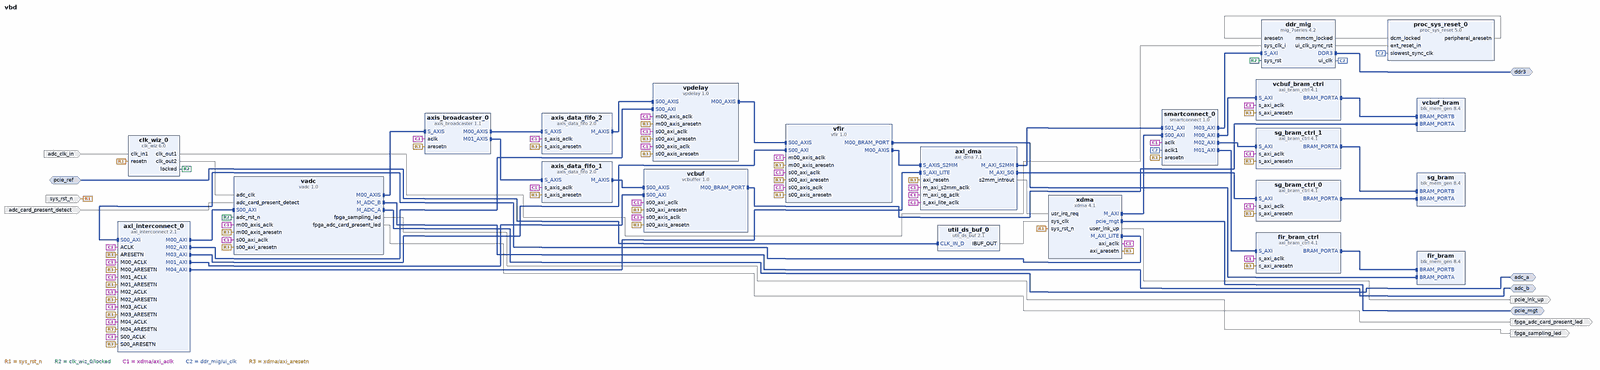
[diagram p0: block diagram of the top level, whole]
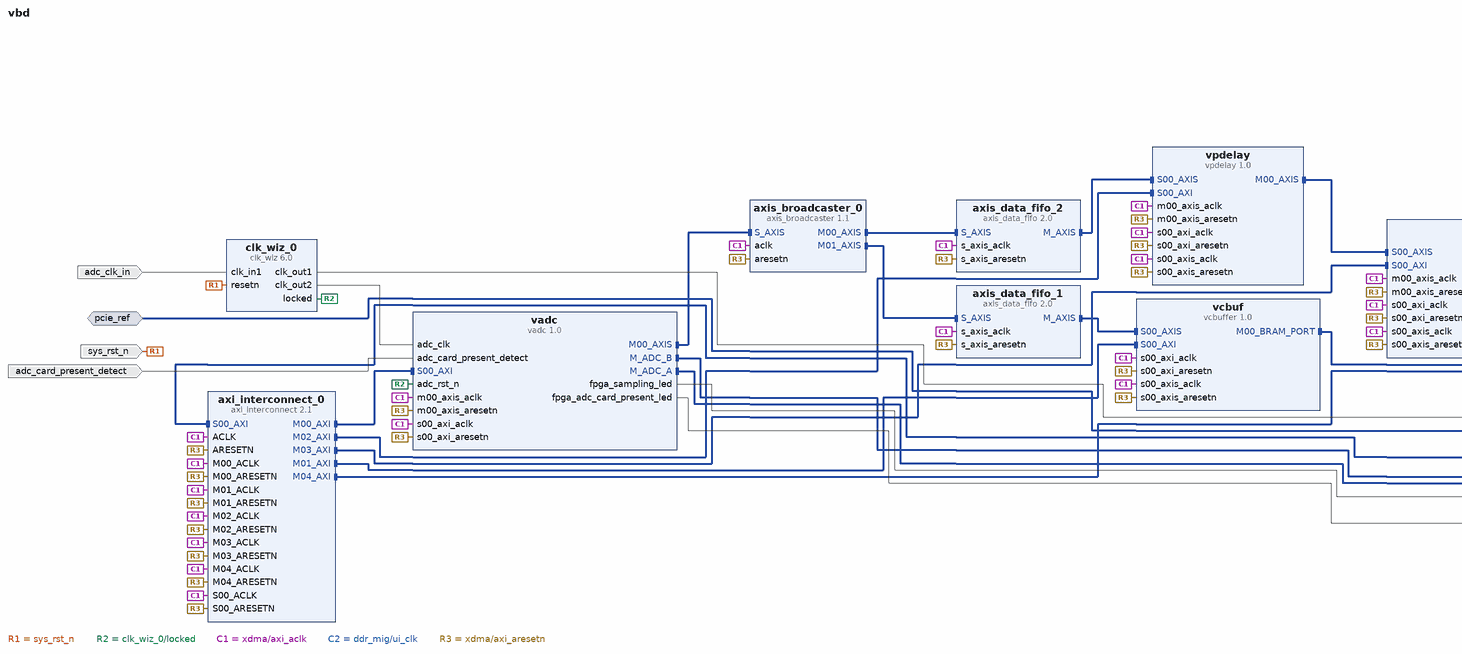
[diagram p1: block diagram of the top level, left part]
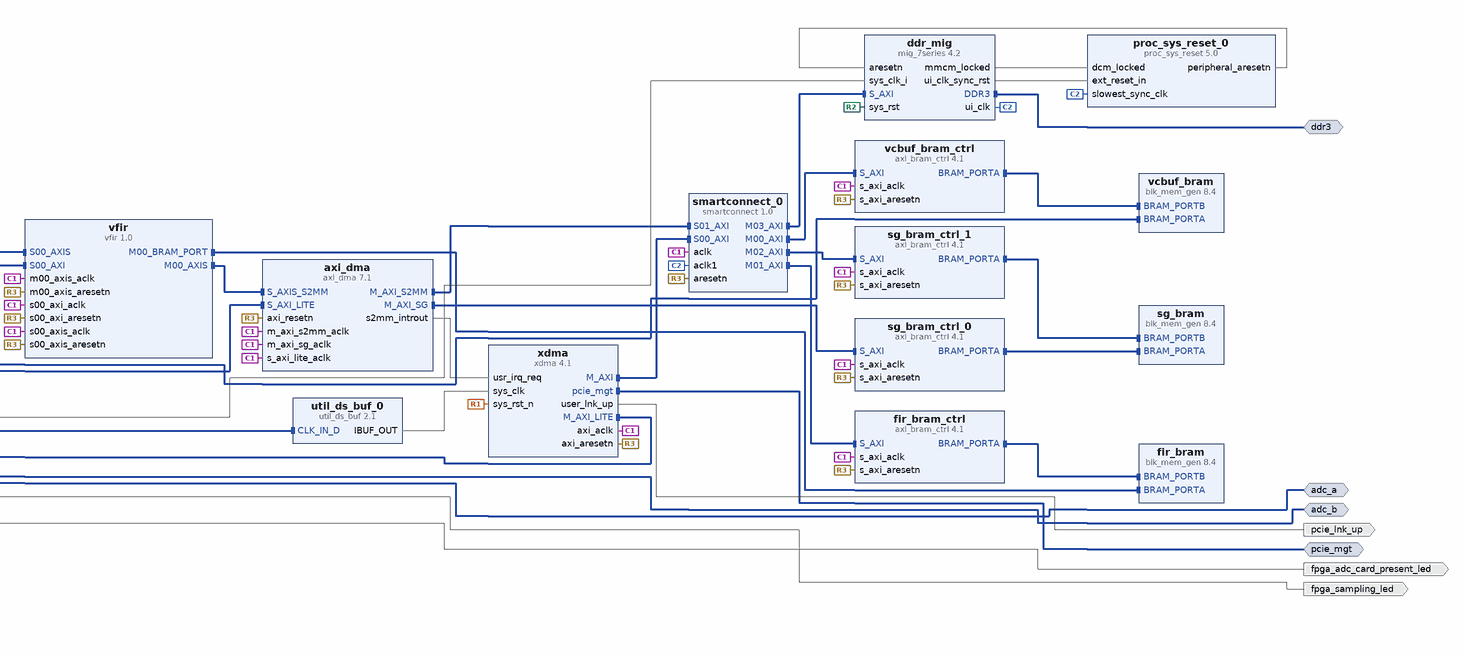
[diagram p2: block diagram of the top level, right part]
# Vivado block design vbd, xc7a100tfgg484-2, Vivado 2020.2
create_bd_design vbd

create_bd_intf_port -mode Master -vlnv xilinx.com:interface:ddrx_rtl:1.0 ddr3
create_bd_intf_port -mode Slave -vlnv xilinx.com:interface:diff_clock_rtl:1.0 pcie_ref
create_bd_intf_port -mode Master -vlnv xilinx.com:interface:pcie_7x_mgt_rtl:1.0 pcie_mgt
create_bd_intf_port -mode Master -vlnv xilinx.com:user:VUPRS_ADC_rtl:1.0 adc_a
create_bd_intf_port -mode Master -vlnv xilinx.com:user:VUPRS_ADC_rtl:1.0 adc_b
create_bd_port -dir I -type rst sys_rst_n
set_property -dict {CONFIG.POLARITY ACTIVE_LOW} [get_bd_ports sys_rst_n]
create_bd_port -dir O pcie_lnk_up
create_bd_port -dir I -type clk adc_clk_in
set_property -dict {CONFIG.FREQ_HZ 50000000} [get_bd_ports adc_clk_in]
create_bd_port -dir I adc_card_present_detect
create_bd_port -dir O fpga_sampling_led
create_bd_port -dir O fpga_adc_card_present_led

create_bd_cell -type ip -vlnv xilinx.com:ip:axis_broadcaster:1.1 axis_broadcaster_0
set_property -dict [list \
  CONFIG.HAS_TLAST 1 \
  CONFIG.HAS_TSTRB 1 \
  CONFIG.M00_TDATA_REMAP {tdata[31:0]} \
  CONFIG.M01_TDATA_REMAP {tdata[31:0]} \
  CONFIG.M_TDATA_NUM_BYTES 4 \
  CONFIG.S_TDATA_NUM_BYTES 4 \
] [get_bd_cells axis_broadcaster_0]
create_bd_cell -type ip -vlnv xilinx.com:ip:xdma:4.1 xdma
set_property -dict [list \
  CONFIG.PF0_DEVICE_ID_mqdma 9022 \
  CONFIG.PF2_DEVICE_ID_mqdma 9022 \
  CONFIG.PF3_DEVICE_ID_mqdma 9022 \
  CONFIG.axilite_master_en true \
  CONFIG.axisten_freq 125 \
  CONFIG.cfg_mgmt_if false \
  CONFIG.pciebar2axibar_axil_master 0x40000000 \
  CONFIG.pf0_device_id 7022 \
  CONFIG.pf0_interrupt_pin NONE \
  CONFIG.pf0_msix_cap_pba_bir BAR_3:2 \
  CONFIG.pf0_msix_cap_pba_offset 00008FE0 \
  CONFIG.pf0_msix_cap_table_bir BAR_3:2 \
  CONFIG.pf0_msix_cap_table_offset 00008000 \
  CONFIG.pf0_msix_cap_table_size 01F \
  CONFIG.pf0_msix_enabled true \
  CONFIG.pl_link_cap_max_link_speed 5.0_GT/s \
  CONFIG.pl_link_cap_max_link_width X2 \
  CONFIG.plltype QPLL1 \
  CONFIG.xdma_axilite_slave false \
  CONFIG.xdma_pcie_64bit_en true \
  CONFIG.xdma_rnum_chnl 2 \
  CONFIG.xdma_wnum_chnl 2 \
] [get_bd_cells xdma]
create_bd_cell -type ip -vlnv xilinx.com:ip:axis_data_fifo:2.0 axis_data_fifo_1
set_property -dict [list \
  CONFIG.FIFO_DEPTH 512 \
  CONFIG.HAS_AEMPTY 1 \
  CONFIG.HAS_AFULL 1 \
  CONFIG.HAS_TLAST 1 \
  CONFIG.HAS_TSTRB 1 \
  CONFIG.TDATA_NUM_BYTES 4 \
] [get_bd_cells axis_data_fifo_1]
create_bd_cell -type ip -vlnv xilinx.com:ip:axis_data_fifo:2.0 axis_data_fifo_2
set_property -dict [list \
  CONFIG.FIFO_DEPTH 128 \
  CONFIG.HAS_TLAST 1 \
  CONFIG.HAS_TSTRB 1 \
  CONFIG.TDATA_NUM_BYTES 4 \
] [get_bd_cells axis_data_fifo_2]
create_bd_cell -type ip -vlnv xilinx.com:ip:blk_mem_gen:8.4 vcbuf_bram
set_property -dict [list \
  CONFIG.Additional_Inputs_for_Power_Estimation false \
  CONFIG.Assume_Synchronous_Clk true \
  CONFIG.EN_SAFETY_CKT false \
  CONFIG.Enable_32bit_Address true \
  CONFIG.Enable_B Use_ENB_Pin \
  CONFIG.Memory_Type True_Dual_Port_RAM \
  CONFIG.Port_A_Write_Rate 50 \
  CONFIG.Port_B_Clock 100 \
  CONFIG.Port_B_Enable_Rate 100 \
  CONFIG.Port_B_Write_Rate 50 \
  CONFIG.Register_PortA_Output_of_Memory_Primitives false \
  CONFIG.Use_RSTA_Pin true \
  CONFIG.Use_RSTB_Pin true \
  CONFIG.use_bram_block BRAM_Controller \
] [get_bd_cells vcbuf_bram]
create_bd_cell -type ip -vlnv xilinx.com:ip:axi_bram_ctrl:4.1 vcbuf_bram_ctrl
set_property -dict {CONFIG.SINGLE_PORT_BRAM 1} [get_bd_cells vcbuf_bram_ctrl]
create_bd_cell -type ip -vlnv xilinx.com:ip:blk_mem_gen:8.4 fir_bram
set_property -dict [list \
  CONFIG.Additional_Inputs_for_Power_Estimation false \
  CONFIG.Assume_Synchronous_Clk true \
  CONFIG.EN_SAFETY_CKT false \
  CONFIG.Enable_32bit_Address true \
  CONFIG.Enable_B Use_ENB_Pin \
  CONFIG.Memory_Type True_Dual_Port_RAM \
  CONFIG.Port_A_Write_Rate 50 \
  CONFIG.Port_B_Clock 100 \
  CONFIG.Port_B_Enable_Rate 100 \
  CONFIG.Port_B_Write_Rate 50 \
  CONFIG.Register_PortA_Output_of_Memory_Primitives false \
  CONFIG.Use_RSTA_Pin true \
  CONFIG.Use_RSTB_Pin true \
  CONFIG.use_bram_block BRAM_Controller \
] [get_bd_cells fir_bram]
create_bd_cell -type ip -vlnv xilinx.com:ip:axi_bram_ctrl:4.1 fir_bram_ctrl
set_property -dict {CONFIG.SINGLE_PORT_BRAM 1} [get_bd_cells fir_bram_ctrl]
create_bd_cell -type ip -vlnv xilinx.com:ip:axi_dma:7.1 axi_dma
set_property -dict [list \
  CONFIG.c_include_mm2s 0 \
  CONFIG.c_include_s2mm 1 \
  CONFIG.c_sg_include_stscntrl_strm 0 \
  CONFIG.c_sg_length_width 26 \
] [get_bd_cells axi_dma]
create_bd_cell -type ip -vlnv xilinx.com:ip:mig_7series:4.2 ddr_mig
set_property -dict [list \
  CONFIG.BOARD_MIG_PARAM Custom \
  CONFIG.MIG_DONT_TOUCH_PARAM Custom \
  CONFIG.RESET_BOARD_INTERFACE Custom \
  CONFIG.XML_INPUT_FILE mig_a.prj \
] [get_bd_cells ddr_mig]
create_bd_cell -type ip -vlnv xilinx.com:ip:blk_mem_gen:8.4 sg_bram
set_property -dict [list \
  CONFIG.Additional_Inputs_for_Power_Estimation false \
  CONFIG.Assume_Synchronous_Clk false \
  CONFIG.EN_SAFETY_CKT false \
  CONFIG.Enable_32bit_Address true \
  CONFIG.Enable_B Use_ENB_Pin \
  CONFIG.Memory_Type True_Dual_Port_RAM \
  CONFIG.Port_A_Write_Rate 50 \
  CONFIG.Port_B_Clock 100 \
  CONFIG.Port_B_Enable_Rate 100 \
  CONFIG.Port_B_Write_Rate 50 \
  CONFIG.Register_PortA_Output_of_Memory_Primitives false \
  CONFIG.Use_RSTA_Pin true \
  CONFIG.Use_RSTB_Pin true \
  CONFIG.use_bram_block BRAM_Controller \
] [get_bd_cells sg_bram]
create_bd_cell -type ip -vlnv xilinx.com:ip:axi_bram_ctrl:4.1 sg_bram_ctrl_0
set_property -dict {CONFIG.SINGLE_PORT_BRAM 1} [get_bd_cells sg_bram_ctrl_0]
create_bd_cell -type ip -vlnv xilinx.com:ip:axi_bram_ctrl:4.1 sg_bram_ctrl_1
set_property -dict {CONFIG.SINGLE_PORT_BRAM 1} [get_bd_cells sg_bram_ctrl_1]
create_bd_cell -type ip -vlnv xilinx.com:ip:util_ds_buf:2.1 util_ds_buf_0
set_property -dict {CONFIG.C_BUF_TYPE IBUFDSGTE} [get_bd_cells util_ds_buf_0]
create_bd_cell -type ip -vlnv xilinx.com:ip:axi_interconnect:2.1 axi_interconnect_0
set_property -dict {CONFIG.NUM_MI 5 CONFIG.STRATEGY 0} [get_bd_cells axi_interconnect_0]
create_bd_cell -type ip -vlnv xilinx.com:ip:smartconnect:1.0 smartconnect_0
set_property -dict {CONFIG.NUM_CLKS 2 CONFIG.NUM_MI 4} [get_bd_cells smartconnect_0]
create_bd_cell -type ip -vlnv xilinx.com:ip:clk_wiz:6.0 clk_wiz_0
set_property -dict [list \
  CONFIG.CLKIN1_JITTER_PS 200.0 \
  CONFIG.CLKOUT1_JITTER 142.107 \
  CONFIG.CLKOUT1_PHASE_ERROR 164.985 \
  CONFIG.CLKOUT1_REQUESTED_OUT_FREQ 200.000 \
  CONFIG.CLKOUT2_JITTER 192.113 \
  CONFIG.CLKOUT2_PHASE_ERROR 164.985 \
  CONFIG.CLKOUT2_REQUESTED_OUT_FREQ 50.000 \
  CONFIG.CLKOUT2_USED true \
  CONFIG.MMCM_CLKFBOUT_MULT_F 20.000 \
  CONFIG.MMCM_CLKIN1_PERIOD 20.000 \
  CONFIG.MMCM_CLKIN2_PERIOD 10.0 \
  CONFIG.MMCM_CLKOUT0_DIVIDE_F 5.000 \
  CONFIG.MMCM_CLKOUT1_DIVIDE 20 \
  CONFIG.MMCM_DIVCLK_DIVIDE 1 \
  CONFIG.NUM_OUT_CLKS 2 \
  CONFIG.PRIM_IN_FREQ 50.000 \
  CONFIG.RESET_PORT resetn \
  CONFIG.RESET_TYPE ACTIVE_LOW \
] [get_bd_cells clk_wiz_0]
create_bd_cell -type ip -vlnv xilinx.com:ip:proc_sys_reset:5.0 proc_sys_reset_0
create_bd_cell -type ip -vlnv xilinx.com:user:vadc:1.0 vadc
create_bd_cell -type ip -vlnv xilinx.com:user:vcbuffer:1.0 vcbuf
set_property -dict {CONFIG.CIRCULAR_BUFFER_POINTS 512} [get_bd_cells vcbuf]
create_bd_cell -type ip -vlnv xilinx.com:user:vpdelay:1.0 vpdelay
create_bd_cell -type ip -vlnv xilinx.com:user:vfir:1.0 vfir
set_property -dict {CONFIG.MAXIMUM_FILTER_LENGTH 256} [get_bd_cells vfir]

# ---- connections ----

connect_bd_intf_net -intf_net mig_7series_0_DDR3 [get_bd_intf_ports ddr3] [get_bd_intf_pins ddr_mig/DDR3]
connect_bd_intf_net [get_bd_intf_pins vadc/S00_AXI] [get_bd_intf_pins axi_interconnect_0/M00_AXI]
connect_bd_intf_net -intf_net axi_dma_0_M_AXI_S2MM [get_bd_intf_pins axi_dma/M_AXI_S2MM] [get_bd_intf_pins smartconnect_0/S01_AXI]
connect_bd_intf_net -intf_net axi_bram_ctrl_1_BRAM_PORTA [get_bd_intf_pins fir_bram_ctrl/BRAM_PORTA] [get_bd_intf_pins fir_bram/BRAM_PORTB]
connect_bd_intf_net [get_bd_intf_pins fir_bram_ctrl/S_AXI] [get_bd_intf_pins smartconnect_0/M01_AXI]
connect_bd_intf_net -intf_net vcbuffer_0_M00_BRAM_PORT [get_bd_intf_pins vcbuf/M00_BRAM_PORT] [get_bd_intf_pins vcbuf_bram/BRAM_PORTA]
connect_bd_intf_net -intf_net xdma_0_pcie_mgt [get_bd_intf_ports pcie_mgt] [get_bd_intf_pins xdma/pcie_mgt]
connect_bd_intf_net [get_bd_intf_pins axi_dma/S_AXI_LITE] [get_bd_intf_pins axi_interconnect_0/M04_AXI]
connect_bd_intf_net [get_bd_intf_ports adc_b] [get_bd_intf_pins vadc/M_ADC_B]
connect_bd_intf_net [get_bd_intf_pins vfir/S00_AXI] [get_bd_intf_pins axi_interconnect_0/M03_AXI]
connect_bd_intf_net [get_bd_intf_pins vpdelay/S00_AXI] [get_bd_intf_pins axi_interconnect_0/M02_AXI]
connect_bd_intf_net [get_bd_intf_pins axis_broadcaster_0/M01_AXIS] [get_bd_intf_pins axis_data_fifo_1/S_AXIS]
connect_bd_intf_net -intf_net axi_bram_ctrl_2_BRAM_PORTA [get_bd_intf_pins sg_bram_ctrl_0/BRAM_PORTA] [get_bd_intf_pins sg_bram/BRAM_PORTA]
connect_bd_intf_net [get_bd_intf_pins sg_bram_ctrl_1/S_AXI] [get_bd_intf_pins smartconnect_0/M02_AXI]
connect_bd_intf_net -intf_net CLK_IN_D_0_1 [get_bd_intf_ports pcie_ref] [get_bd_intf_pins util_ds_buf_0/CLK_IN_D]
connect_bd_intf_net -intf_net vpdelay_0_M00_AXIS [get_bd_intf_pins vpdelay/M00_AXIS] [get_bd_intf_pins vfir/S00_AXIS]
connect_bd_intf_net [get_bd_intf_pins vfir/M00_BRAM_PORT] [get_bd_intf_pins fir_bram/BRAM_PORTA]
connect_bd_intf_net [get_bd_intf_pins ddr_mig/S_AXI] [get_bd_intf_pins smartconnect_0/M03_AXI]
connect_bd_intf_net [get_bd_intf_pins axis_data_fifo_1/M_AXIS] [get_bd_intf_pins vcbuf/S00_AXIS]
connect_bd_intf_net [get_bd_intf_pins axis_data_fifo_2/M_AXIS] [get_bd_intf_pins vpdelay/S00_AXIS]
connect_bd_intf_net [get_bd_intf_pins axis_broadcaster_0/M00_AXIS] [get_bd_intf_pins axis_data_fifo_2/S_AXIS]
connect_bd_intf_net [get_bd_intf_pins vcbuf/S00_AXI] [get_bd_intf_pins axi_interconnect_0/M01_AXI]
connect_bd_intf_net -intf_net vfir_0_M00_AXIS [get_bd_intf_pins vfir/M00_AXIS] [get_bd_intf_pins axi_dma/S_AXIS_S2MM]
connect_bd_intf_net [get_bd_intf_pins axis_broadcaster_0/S_AXIS] [get_bd_intf_pins vadc/M00_AXIS]
connect_bd_intf_net -intf_net axi_bram_ctrl_3_BRAM_PORTA [get_bd_intf_pins sg_bram_ctrl_1/BRAM_PORTA] [get_bd_intf_pins sg_bram/BRAM_PORTB]
connect_bd_intf_net [get_bd_intf_pins vcbuf_bram_ctrl/S_AXI] [get_bd_intf_pins smartconnect_0/M00_AXI]
connect_bd_intf_net -intf_net axi_dma_0_M_AXI_SG [get_bd_intf_pins axi_dma/M_AXI_SG] [get_bd_intf_pins sg_bram_ctrl_0/S_AXI]
connect_bd_intf_net [get_bd_intf_ports adc_a] [get_bd_intf_pins vadc/M_ADC_A]
connect_bd_intf_net -intf_net axi_bram_ctrl_0_BRAM_PORTA [get_bd_intf_pins vcbuf_bram_ctrl/BRAM_PORTA] [get_bd_intf_pins vcbuf_bram/BRAM_PORTB]
connect_bd_intf_net -intf_net xdma_0_M_AXI [get_bd_intf_pins xdma/M_AXI] [get_bd_intf_pins smartconnect_0/S00_AXI]
connect_bd_intf_net -intf_net xdma_0_M_AXI_LITE [get_bd_intf_pins xdma/M_AXI_LITE] [get_bd_intf_pins axi_interconnect_0/S00_AXI]
connect_bd_net -net reset_rtl_0_1 [get_bd_ports sys_rst_n] [get_bd_pins xdma/sys_rst_n] [get_bd_pins clk_wiz_0/resetn]
connect_bd_net [get_bd_pins util_ds_buf_0/IBUF_OUT] [get_bd_pins xdma/sys_clk]
connect_bd_net -net xdma_0_user_lnk_up [get_bd_pins xdma/user_lnk_up] [get_bd_ports pcie_lnk_up]
connect_bd_net -net clk_in1_0_1 [get_bd_ports adc_clk_in] [get_bd_pins clk_wiz_0/clk_in1]
connect_bd_net [get_bd_pins clk_wiz_0/clk_out1] [get_bd_pins ddr_mig/sys_clk_i]
connect_bd_net [get_bd_pins clk_wiz_0/clk_out2] [get_bd_pins vadc/adc_clk]
connect_bd_net [get_bd_pins clk_wiz_0/locked] [get_bd_pins ddr_mig/sys_rst] [get_bd_pins vadc/adc_rst_n]
connect_bd_net [get_bd_pins proc_sys_reset_0/peripheral_aresetn] [get_bd_pins ddr_mig/aresetn]
connect_bd_net -net mig_7series_0_mmcm_locked [get_bd_pins ddr_mig/mmcm_locked] [get_bd_pins proc_sys_reset_0/dcm_locked]
connect_bd_net -net mig_7series_0_ui_clk_sync_rst [get_bd_pins ddr_mig/ui_clk_sync_rst] [get_bd_pins proc_sys_reset_0/ext_reset_in]
connect_bd_net [get_bd_pins xdma/axi_aclk] \
  [get_bd_pins smartconnect_0/aclk] [get_bd_pins axi_interconnect_0/ACLK] [get_bd_pins axi_interconnect_0/S00_ACLK] \
  [get_bd_pins axi_interconnect_0/M00_ACLK] [get_bd_pins axi_interconnect_0/M01_ACLK] \
  [get_bd_pins axi_interconnect_0/M02_ACLK] [get_bd_pins axi_interconnect_0/M03_ACLK] \
  [get_bd_pins axi_interconnect_0/M04_ACLK] [get_bd_pins axis_broadcaster_0/aclk] [get_bd_pins axis_data_fifo_1/s_axis_aclk] \
  [get_bd_pins axis_data_fifo_2/s_axis_aclk] [get_bd_pins axi_dma/s_axi_lite_aclk] [get_bd_pins axi_dma/m_axi_sg_aclk] \
  [get_bd_pins axi_dma/m_axi_s2mm_aclk] [get_bd_pins sg_bram_ctrl_0/s_axi_aclk] [get_bd_pins sg_bram_ctrl_1/s_axi_aclk] \
  [get_bd_pins fir_bram_ctrl/s_axi_aclk] [get_bd_pins vcbuf_bram_ctrl/s_axi_aclk] [get_bd_pins vadc/s00_axi_aclk] \
  [get_bd_pins vadc/m00_axis_aclk] [get_bd_pins vcbuf/s00_axi_aclk] [get_bd_pins vcbuf/s00_axis_aclk] \
  [get_bd_pins vpdelay/s00_axi_aclk] [get_bd_pins vpdelay/s00_axis_aclk] [get_bd_pins vpdelay/m00_axis_aclk] \
  [get_bd_pins vfir/s00_axi_aclk] [get_bd_pins vfir/s00_axis_aclk] [get_bd_pins vfir/m00_axis_aclk]
connect_bd_net -net adc_card_present_detect_0_1 [get_bd_ports adc_card_present_detect] [get_bd_pins vadc/adc_card_present_detect]
connect_bd_net -net mig_7series_0_ui_clk [get_bd_pins ddr_mig/ui_clk] \
  [get_bd_pins smartconnect_0/aclk1] [get_bd_pins proc_sys_reset_0/slowest_sync_clk]
connect_bd_net -net xdma_0_axi_aresetn [get_bd_pins xdma/axi_aresetn] \
  [get_bd_pins sg_bram_ctrl_1/s_axi_aresetn] [get_bd_pins sg_bram_ctrl_0/s_axi_aresetn] \
  [get_bd_pins fir_bram_ctrl/s_axi_aresetn] [get_bd_pins vcbuf_bram_ctrl/s_axi_aresetn] [get_bd_pins smartconnect_0/aresetn] \
  [get_bd_pins axi_dma/axi_resetn] [get_bd_pins axis_data_fifo_1/s_axis_aresetn] \
  [get_bd_pins axis_data_fifo_2/s_axis_aresetn] [get_bd_pins axis_broadcaster_0/aresetn] \
  [get_bd_pins axi_interconnect_0/M04_ARESETN] [get_bd_pins axi_interconnect_0/M03_ARESETN] \
  [get_bd_pins axi_interconnect_0/M02_ARESETN] [get_bd_pins axi_interconnect_0/M01_ARESETN] \
  [get_bd_pins axi_interconnect_0/M00_ARESETN] [get_bd_pins axi_interconnect_0/S00_ARESETN] \
  [get_bd_pins axi_interconnect_0/ARESETN] [get_bd_pins vadc/s00_axi_aresetn] [get_bd_pins vadc/m00_axis_aresetn] \
  [get_bd_pins vcbuf/s00_axi_aresetn] [get_bd_pins vcbuf/s00_axis_aresetn] [get_bd_pins vpdelay/s00_axi_aresetn] \
  [get_bd_pins vpdelay/s00_axis_aresetn] [get_bd_pins vpdelay/m00_axis_aresetn] [get_bd_pins vfir/s00_axi_aresetn] \
  [get_bd_pins vfir/s00_axis_aresetn] [get_bd_pins vfir/m00_axis_aresetn]
connect_bd_net [get_bd_pins vadc/fpga_sampling_led] [get_bd_ports fpga_sampling_led]
connect_bd_net [get_bd_pins vadc/fpga_adc_card_present_led] [get_bd_ports fpga_adc_card_present_led]
connect_bd_net [get_bd_pins axi_dma/s2mm_introut] [get_bd_pins xdma/usr_irq_req]

# ---- address map ----
assign_bd_address -offset 0x00000000 -range 512M -target_address_space [get_bd_addr_spaces axi_dma/Data_S2MM] [get_bd_addr_segs ddr_mig/memmap/memaddr]
assign_bd_address -offset 0x20010000 -range 32K -target_address_space [get_bd_addr_spaces axi_dma/Data_S2MM] [get_bd_addr_segs fir_bram_ctrl/S_AXI/Mem0]
assign_bd_address -offset 0x20020000 -range 16K -target_address_space [get_bd_addr_spaces axi_dma/Data_S2MM] [get_bd_addr_segs sg_bram_ctrl_1/S_AXI/Mem0]
assign_bd_address -offset 0x20030000 -range 32K -target_address_space [get_bd_addr_spaces axi_dma/Data_S2MM] [get_bd_addr_segs vcbuf_bram_ctrl/S_AXI/Mem0]
assign_bd_address -offset 0x20020000 -range 16K -target_address_space [get_bd_addr_spaces axi_dma/Data_SG] [get_bd_addr_segs sg_bram_ctrl_0/S_AXI/Mem0]
assign_bd_address -offset 0x0000000000000000 -range 512M -target_address_space [get_bd_addr_spaces xdma/M_AXI] [get_bd_addr_segs ddr_mig/memmap/memaddr]
assign_bd_address -offset 0x0000000020010000 -range 32K -target_address_space [get_bd_addr_spaces xdma/M_AXI] [get_bd_addr_segs fir_bram_ctrl/S_AXI/Mem0]
assign_bd_address -offset 0x0000000020020000 -range 16K -target_address_space [get_bd_addr_spaces xdma/M_AXI] [get_bd_addr_segs sg_bram_ctrl_1/S_AXI/Mem0]
assign_bd_address -offset 0x0000000020030000 -range 32K -target_address_space [get_bd_addr_spaces xdma/M_AXI] [get_bd_addr_segs vcbuf_bram_ctrl/S_AXI/Mem0]
assign_bd_address -offset 0x40000000 -range 64K -target_address_space [get_bd_addr_spaces xdma/M_AXI_LITE] [get_bd_addr_segs axi_dma/S_AXI_LITE/Reg]
assign_bd_address -offset 0x40010000 -range 64K -target_address_space [get_bd_addr_spaces xdma/M_AXI_LITE] [get_bd_addr_segs vadc/S00_AXI/S00_AXI_reg]
assign_bd_address -offset 0x40020000 -range 64K -target_address_space [get_bd_addr_spaces xdma/M_AXI_LITE] [get_bd_addr_segs vcbuf/S00_AXI/S00_AXI_reg]
assign_bd_address -offset 0x40030000 -range 64K -target_address_space [get_bd_addr_spaces xdma/M_AXI_LITE] [get_bd_addr_segs vfir/S00_AXI/S00_AXI_reg]
assign_bd_address -offset 0x40040000 -range 64K -target_address_space [get_bd_addr_spaces xdma/M_AXI_LITE] [get_bd_addr_segs vpdelay/S00_AXI/S00_AXI_reg]

validate_bd_design
save_bd_design
